# EAGLE design esp8266 (EAGLE 9.5.1)
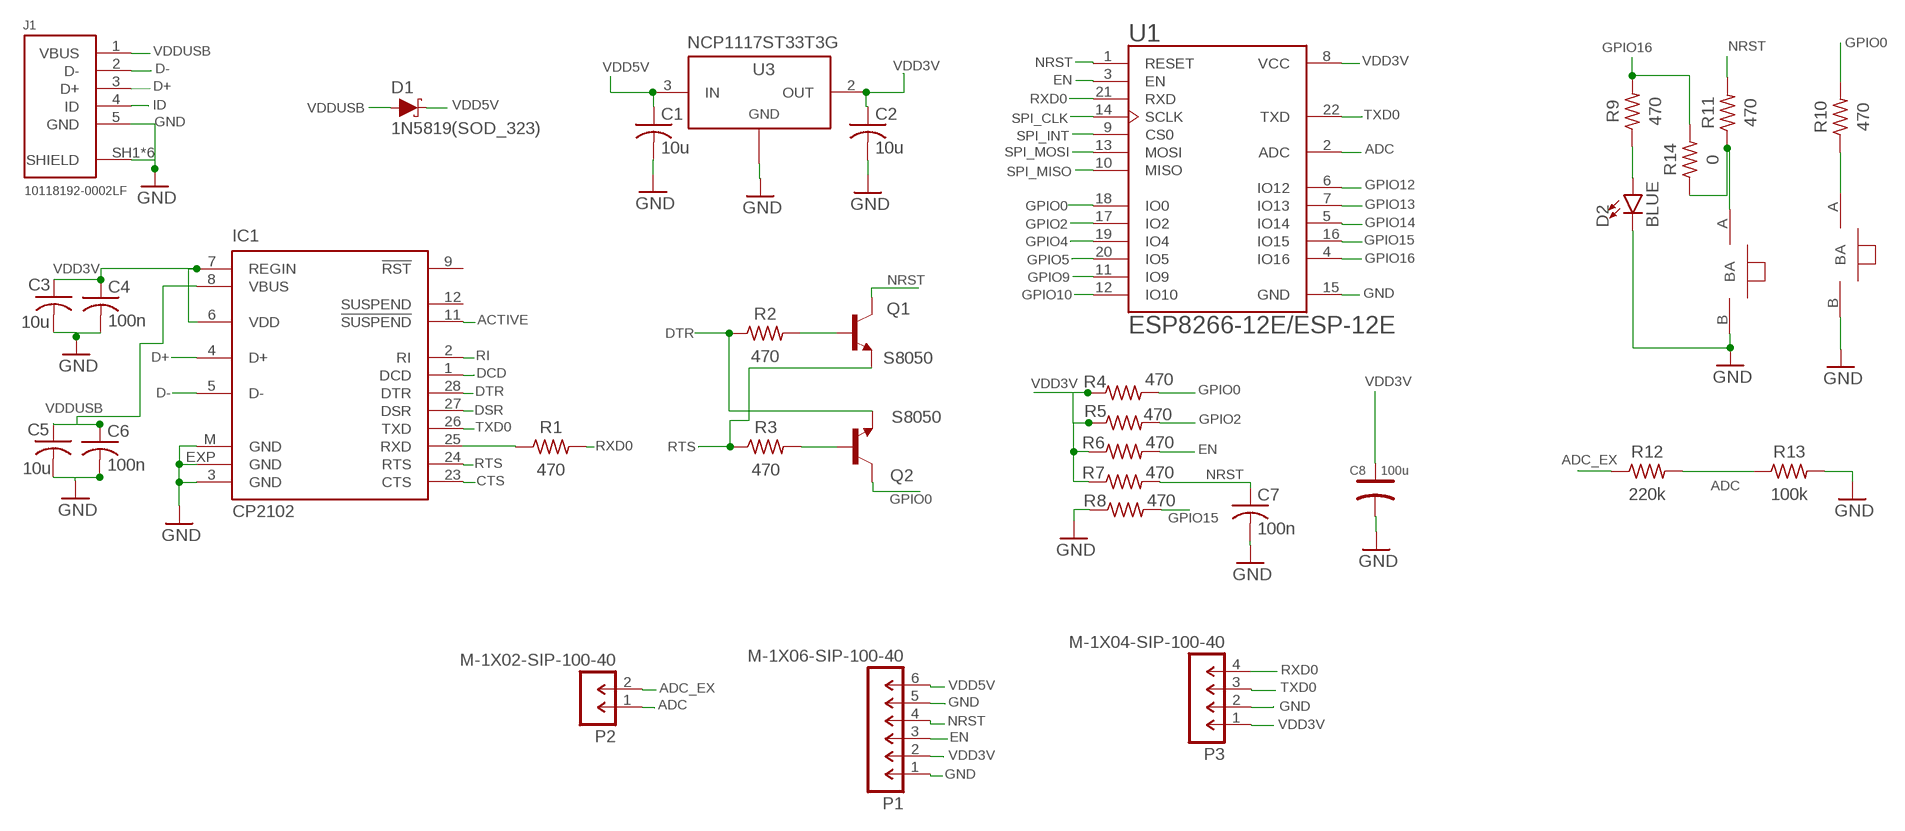
[diagram p0: schematic, sheet 1]

## Parts
C1  10u  C-US_CHIP-0805(2012-METRIC)  [CAPC2012X110]
C2  10u  C-US_CHIP-0402(1005-METRIC)  [CAPC1005X60]
C3  10u  C-US_CHIP-0402(1005-METRIC)  [CAPC1005X60]
C4  100n  C-US_CHIP-0402(1005-METRIC)  [CAPC1005X60]
C5  10u  C-US_CHIP-0402(1005-METRIC)  [CAPC1005X60]
C6  100n  C-US_CHIP-0402(1005-METRIC)  [CAPC1005X60]
C7  100n  C-US_CHIP-0402(1005-METRIC)  [CAPC1005X60]
C8  100u  TANTALUM-SMD-100UF-6.3V(AVX-B)  [AVX-B]
D1  1N5819(SOD_323)  DIODE-SCHOTTKY-BAT20J  [SOD-323]
D2  BLUE  LED-BLUE0603  [LED-0603]
IC1  CP2102  [MLP28]
J1  10118192-0002LF  [10118192-0002LF]
P1  M-1X06-SIP-100-40  [SIP-100-06-40]
P2  M-1X02-SIP-100-40  [SIP-100-02-40]
P3  M-1X04-SIP-100-40  [SIP-100-04-40]
Q1  S8050  BCX70SMD  [SOT23]
Q2  S8050  BCX70SMD  [SOT23]
R1  470  R-US_CHIP-0402(1005-METRIC)  [RESC1005X40]
R2  470  R-US_CHIP-0402(1005-METRIC)  [RESC1005X40]
R3  470  R-US_CHIP-0402(1005-METRIC)  [RESC1005X40]
R4  470  R-US_CHIP-0402(1005-METRIC)  [RESC1005X40]
R5  470  R-US_CHIP-0402(1005-METRIC)  [RESC1005X40]
R6  470  R-US_CHIP-0402(1005-METRIC)  [RESC1005X40]
R7  470  R-US_CHIP-0402(1005-METRIC)  [RESC1005X40]
R8  470  R-US_CHIP-0402(1005-METRIC)  [RESC1005X40]
R9  470  R-US_CHIP-0402(1005-METRIC)  [RESC1005X40]
R10  470  R-US_CHIP-0402(1005-METRIC)  [RESC1005X40]
R11  470  R-US_CHIP-0402(1005-METRIC)  [RESC1005X40]
R12  220k  R-US_CHIP-0402(1005-METRIC)  [RESC1005X40]
R13  100k  R-US_CHIP-0402(1005-METRIC)  [RESC1005X40]
R14  0  R-US_CHIP-0402(1005-METRIC)  [RESC1005X40]
U1  ESP8266-12E/ESP-12E  [XCVR_ESP8266-12E/ESP-12E]
U3  NCP1117ST33T3G  [SOT-223]
U$2  PT_820  [PT_820]
U$3  PT_820  [PT_820]

## Nets
ACTIVE: IC1.11(!SUSPEND)
ADC: P2.1 R12.2 R13.1 U1.2(ADC)
ADC_EX: P2.2 R12.1
CTS: IC1.23(CTS)
D+: IC1.4(D+) J1.3(D+)
D-: IC1.5(D-) J1.2(D-)
DCD: IC1.1(DCD)
DSR: IC1.27(DSR)
DTR: IC1.28(DTR) Q2.2(E) R2.1
EN: P1.3 R6.2 U1.3(EN)
GND: C1.2 C2.2 C3.2 C4.2 C5.2 C6.2 C7.2 C8.- D2.C IC1.3(GND) IC1.EXP(GND) IC1.M(GND) J1.5(GND) J1.SH1(SHIELD) J1.SH2(SHIELD) J1.SH3(SHIELD) J1.SH4(SHIELD) J1.SH5(SHIELD) J1.SH6(SHIELD) P1.1 P1.5 P3.2 R8.1 R13.2 U1.15(GND) U3.1(ADJ/GND) U$2.B U$3.B
GPIO0: Q2.3(C) R4.2 R10.2 U1.18(IO0)
GPIO2: R5.2 U1.17(IO2)
GPIO4: U1.19(IO4)
GPIO5: U1.20(IO5)
GPIO9: U1.11(IO9)
GPIO10: U1.12(IO10)
GPIO12: U1.6(IO12)
GPIO13: U1.7(IO13)
GPIO14: U1.5(IO14)
GPIO15: R8.2 U1.16(IO15)
GPIO16: R9.2 R14.2 U1.4(IO16)
ID: J1.4(ID)
N$1: D2.A R9.1
N$2: Q1.1(B) R2.2
N$4: R11.1 R14.1 U$2.A
N$5: Q2.1(B) R3.2
N$6: R10.1 U$3.A
NRST: C7.1 P1.4 Q1.3(C) R7.2 R11.2 U1.1(RESET)
RI: IC1.2(RI)
RTS: IC1.24(RTS) Q1.2(E) R3.1
RX: IC1.25(RXD) R1.1
RXD0: P3.4 R1.2 U1.21(RXD)
SPI_CLK: U1.14(SCLK)
SPI_INT: U1.9(CS0)
SPI_MISO: U1.10(MISO)
SPI_MOSI: U1.13(MOSI)
TXD0: IC1.26(TXD) P3.3 U1.22(TXD)
VDD3V: C2.1 C3.1 C4.1 C8.+ IC1.6(VDD) IC1.7(REGIN) P1.2 P3.1 R4.1 R5.1 R6.1 R7.1 U1.8(VCC) U3.2(OUT) U3.4
VDD5V: C1.1 D1.C P1.6 U3.3(IN)
VDDUSB: C5.1 C6.1 D1.A IC1.8(VBUS) J1.1(VBUS)
Unconnected: IC1.9(!RST) IC1.12(SUSPEND)

## Library data of the parts
C1-C7 = Capacitor:C-US: Capacitor - ANSI; CATEGORY: Capacitor
C8 = TANTALUM-SMD-100UF-6.3V_AVX-B_:TANTALUM-SMD-100UF-6.3V(AVX-B): 302020017 Check prices <https://pricing.snapeda.com/parts/TAJB107M006RNJ/AVX%20Interconnect%20/%20Elco/view-part?ref=eda>; AVAILABILITY: Warning; DESCRIPTION: 100µF Molded Tantalum Capacitors 6.3V 1411 (3528 Metric), 1210 1.7Ohm; MF: AVX Interconnect / Elco; MP: TAJB107M006RNJ; PACKAGE: 1210 AVX Interconnect / Elco; PRICE: None; PURCHASE-URL: https://pricing.snapeda.com/search/part/TAJB107M006RNJ/?ref=eda
D1 = SparkFun-DiscreteSemi:DIODE-SCHOTTKY: Schottky diode A Schottky diode is a semiconductor diode which has a low forward voltage drop and a very fast switching action.; PROD_ID: DIO-11623; VALUE: 1A/23V/620mV
D2 = SparkFun-LED:LED-BLUE: Blue SMD LED Used in manufacturing of various products at SparkFun Packages: 0603 - SMD 0603 package [Product Link] <http://www.digikey.com/product-detail/en/SMLE12BC7TT86/511-1589-2-ND/1641808> 1206 - SMD1206 package [Product Link] <http://www.digikey.com/product-detail/en/lite-on-inc/LTST-C150TBKT/160-1643-1-ND/573584> SparkFun Products: ESP8266 Thing-Dev Board <https://www.sparkfun.com/products/13711> RedBoard <https://www.sparkfun.com/products/12757>; PROD_ID: DIO-08575
IC1 = silabs-2:CP210*: Single-Chip USB to UART Bridge Source: www.silabs.com .. CP2101.pdf / cp2102.pdf
J1 = USB connector:10118192-0002LF: CONN RCPT USB2.0 MICRO B SMD R/A Manufacturer's datasheet <https://www.amphenol-icc.com/media/wysiwyg/files/drawing/10118192.pdf>; CREATED_BY: PCBLayout.com; DIGIKEY_PARTNO: 609-5379-2-ND; MANUFACTURER: Amphenol ICC (FCI); MPN: 10118192-0002LF
P1 = con-headers-jp:M-1X06-: MALE HEADER
P2 = con-headers-jp:M-1X02-: MALE HEADER
P3 = con-headers-jp:M-1X04-: MALE HEADER
Q1 Q2 = transistor-npn:BCX70*: NPN Transistor
R1-R14 = Resistor:R-US: Resistor Fixed - ANSI; CATEGORY: Resistor; SUB-CATEGORY: Fixed
U1 = ESP8266-12E_ESP-12E:ESP8266-12E/ESP-12E: ESP-12E WiFi Module; AVAILABILITY: Unavailable; DESCRIPTION: This WiFi module has a 32-bit MCU micro and clock speeds supporting 80 MHz or 160 MHz. Supports the RTOS and integrated Wi-Fi MAC/BB/RF/PA/LNA, and has an on-board antenna.; MF: AI-Thinker; MP: ESP8266-12E/ESP-12E; PACKAGE: None; PRICE: None
U3 = IC:NCP1117ST33T3G: IC REG LINEAR 3.3V 1A SOT223 Manufacturer's datasheet <https://www.onsemi.com/pub/Collateral/NCP1117-D.PDF>; CREATED_BY: PCBLayout.com; DIGIKEY_PART_NUMBER: NCP1117ST33T3GOSTR-ND; MANUFACTURER: ON Semiconductor; MPN: NCP1117ST33T3G; PACKAGE: SOT-223
U$2 U$3 = PT_820:PT_820

## Board
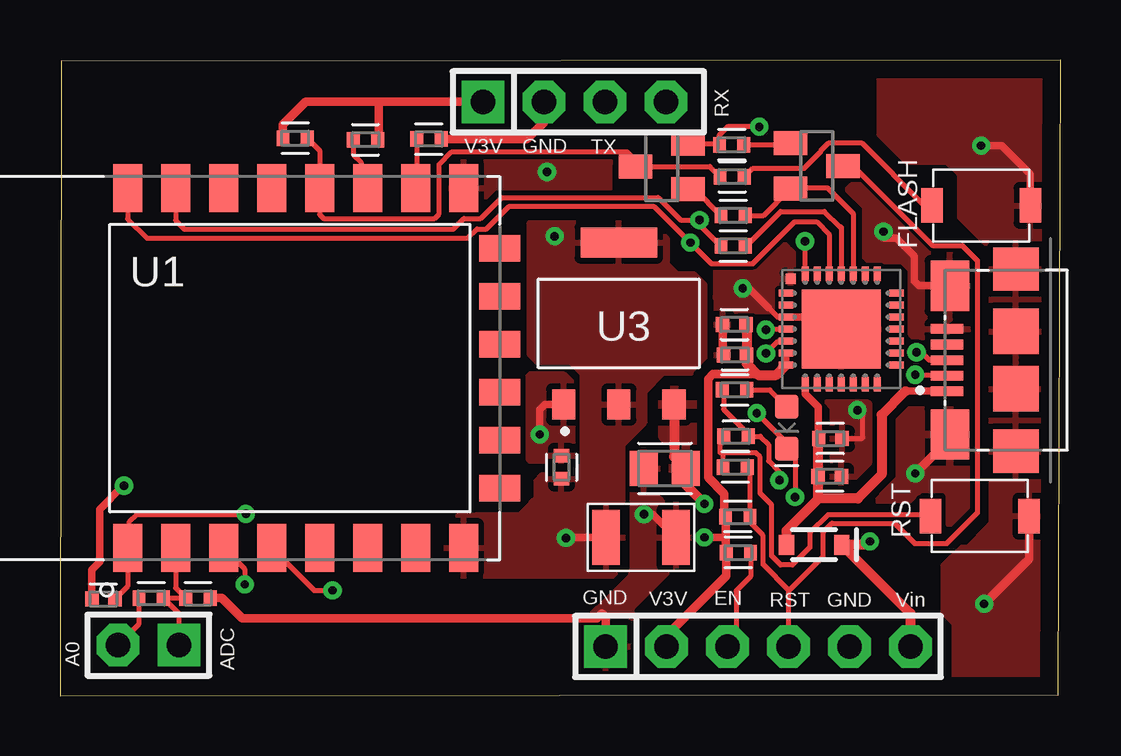
[diagram p1: board, top side]
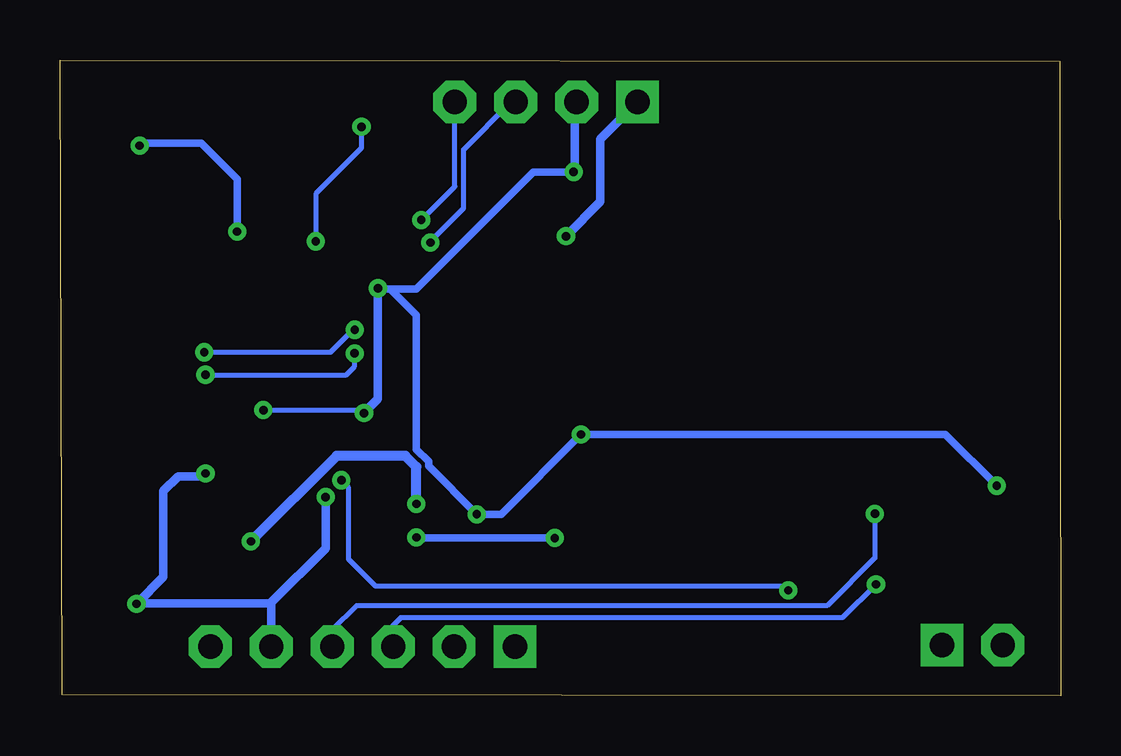
[diagram p2: board, bottom side, seen from below]

Size 41.7 x 26.51 mm. Coordinates in mm from the lower left corner, seen from the top.
Outline: 0,0 41.6,0.05 41.7,26.51 0.05,26.46 0,0
Copper layers (1*16): Top 0.035mm / dielectric 1.5mm / Bottom 0.035mm
Design rules "default *": minimum track width 6mil, minimum drill 0.35mm, track to track 6mil, track to pad 6mil, pad to pad 6mil, via to via 6mil, smd to smd 6mil, copper to edge 30mil, drill to drill 6mil, minimum pad ring 10mil, minimum via ring 8mil, stop-mask expansion 4mil, vias tented up to drill 0mil, thermal gap 10mil

### Footprints (pad centres in the part's own frame; a part is rotated, then mirrored left to right if it is on the bottom)
CAPC2012X110 = smd 1.165 x 1.465: 1 -0.875,0; 2 0.875,0
CAPC1005X60 = smd 0.56 x 0.629: 1 -0.485,0; 2 0.485,0
AVX-B = smd 1.143 x 2.286: + -1.46,0; - 1.46,0
SOD-323 = smd 0.63 x 0.83: A 1.15,0; C -1.15,0
LED-0603 = smd 1 x 1: A -0.877,0; C 0.877,0
MLP28 = smd 0.6 x 0.3: 1 -2.3,1.5; 2 -2.3,1; 3 -2.3,0.5; 4 -2.3,0; 5 -2.3,-0.5; 6 -2.3,-1; 7 -2.3,-1.5; 15 2.3,-1.5; 16 2.3,-1; 17 2.3,-0.5; 18 2.3,0; 19 2.3,0.5; 20 2.3,1; 21 2.3,1.5 | smd 0.3 x 0.6: 8 -1.5,-2.3; 9 -1,-2.3; 10 -0.5,-2.3; 11 0,-2.3; 12 0.5,-2.3; 13 1,-2.3; 14 1.5,-2.3; 22 1.5,2.3; 23 1,2.3; 24 0.5,2.3; 25 0,2.3; 26 -0.5,2.3; 27 -1,2.3; 28 -1.5,2.3 | smd 3.3 x 3.3: EXP 0,0 | smd 0.435 x 0.435: M -2.103,2.103
10118192-0002LF = smd 0.4 x 1.35: 1 -1.3,2.875; 2 -0.65,2.875; 3 0,2.875; 4 0.65,2.875; 5 1.3,2.875 | smd 2.1 x 1.6: SH1 -3.1,2.75; SH2 3.1,2.75 | smd 1.8 x 1.9: SH3 -3.8,0; SH4 3.8,0 | smd 1.9 x 1.9: SH5 -1.2,0; SH6 1.2,0
SIP-100-06-40 = drill 1.016 pad 1.778 square: 1 -6.35,0 | drill 1.016 pad 1.778 octagon: 2 -3.81,0; 3 -1.27,0; 4 1.27,0; 5 3.81,0; 6 6.35,0
SIP-100-02-40 = drill 1.016 pad 1.778 square: 1 -1.27,0 | drill 1.016 pad 1.778 octagon: 2 1.27,0
SIP-100-04-40 = drill 1.016 pad 1.778 square: 1 -3.81,0 | drill 1.016 pad 1.778 octagon: 2 -1.27,0; 3 1.27,0; 4 3.81,0
SOT23 = smd 1 x 1.4: 1 -0.95,-1.1; 2 0.95,-1.1; 3 0,1.1
RESC1005X40 = smd 0.535 x 0.644: 1 -0.507,0; 2 0.507,0
XCVR_ESP8266-12E/ESP-12E = smd 2 x 1.2: 1 -7.5,7; 2 -7.5,5; 3 -7.5,3; 4 -7.5,1; 5 -7.5,-1; 6 -7.5,-3; 7 -7.5,-5; 8 -7.5,-7; 15 7.5,-7; 16 7.5,-5; 17 7.5,-3; 18 7.5,-1; 19 7.5,1; 20 7.5,3; 21 7.5,5; 22 7.5,7 | smd 1.1 x 1.7: 9 -5,-8.5; 10 -3,-8.5; 11 -1,-8.5; 12 1,-8.5; 13 3,-8.5; 14 5,-8.5
SOT-223 = smd 1.26 x 0.96: 1 -3.375,2.3; 2 -3.375,0; 3 -3.375,-2.3 | smd 1.26 x 3.19: 4 3.375,0
PT_820 = smd 0.9 x 1.45: A -2.05,0; B 2.05,0

### Placement (x,y rotation side)
C1  25.2,9.48 180 top
C2  20.9,9.53 90 top
C3  28.1,15.48 180 top
C4  28.12,14.21 180 top
C5  32.1,10.73 0 top
C6  32.07,9.15 0 top
C7  1.81,4.04 180 top
C8  24.21,6.6 0 top
D1  31.42,6.3 180 top
D2  30.28,11.18 270 top
IC1  32.55,15.29 0 top
J1  39.83,14 90 top
P1  29.08,2.06 0 top
P2  3.68,2.11 180 top
P3  21.44,24.77 0 top
Q1  31.53,22.09 270 top
Q2  25.07,22.07 90 top
R1  28.05,18.76 180 top
R2  27.99,22.97 0 top
R3  28.05,20.03 180 top
R4  9.8,23.25 0 top
R5  12.73,23.19 180 top
R6  28.26,5.97 0 top
R7  28.24,7.47 0 top
R8  15.37,23.21 180 top
R9  28.11,12.76 180 top
R10  28.01,21.64 180 top
R11  28.13,9.54 0 top
R12  3.8,4.08 0 top
R13  5.75,4.08 0 top
R14  28.17,10.82 0 top
U1  9.82,13.66 90 top
U3  23.28,15.53 90 top
U$2  38.33,7.49 0 top
U$3  38.38,20.45 0 top

### Tracks (layer width: path | path; a pad name or v marks a point on that pad's centre or on a via)
ADC
  Top 0.203: U1.2 4.82,4.5 R13.1 R12.2 4.95,3.44 P2.1
ADC_EX
  Top 0.203: P2.2 3.28,2.97 3.28,3.43 3.29,3.45 R12.1
D+  (via drill 0.35)
  Top 0.203: v29.41,15.26 29.44,15.29 IC1.4 | v35.69,14.33 35.89,14.33 36.22,14 J1.3
  Bottom 0.203: v29.41,15.26 29.49,15.26 30.42,14.33 v35.69,14.33
D-  (via drill 0.35)
  Top 0.203: v29.42,14.27 29.93,14.79 IC1.5 | v35.64,13.39 36.91,13.39 J1.2
  Bottom 0.203: v29.42,14.27 29.42,13.74 29.77,13.39 v35.64,13.39
DTR  (via drill 0.35)
  Top 0.203: Q2.2 27.43,23.02 R2.1 27.48,23.38 27.82,23.72 v29.13,23.72 | IC1.28 31.05,18.94 v31.04,18.95
  Bottom 0.203: v29.13,23.72 29.13,22.83 31.04,20.93 v31.04,18.95
EN  (via drill 0.35)
  Top 0.203: U1.3 7.7,5.29 v7.7,4.65 | P1.3 28.17,2.41 28.17,4.37 28.77,4.98 R6.2
  Bottom 0.203: v7.7,4.65 9.09,3.25 27.51,3.25 27.81,2.95 P1.3
GND  (via drill 0.35)
  Top 0.203: IC1.3 29.91,15.79 29.52,16.18 | C5.2 33.39,10.73 33.4,10.72 33.45,10.77 33.45,11.68 v33.22,11.91 | v29.03,11.79 30.28,10.53 D2.C 30.63,9.96 v30.63,8.29
  Top 0.305: IC1.3 32.05,15.79 IC1.EXP | v28.45,16.99 28.7,16.99 29.52,16.18 | C8.- 24.7,7.57 v24.33,7.57 | v19.99,10.9 19.99,11.94 20.2,12.15 U3.1 | J1.SH2 35.79,17.1 35.59,17.3 35.59,18.34 34.85,19.08 34.32,19.08 v34.32,19.35 | v38.38,22.94 39.24,22.94 40.44,21.74 U$3.B | C7.2 1.32,5.26 1.65,5.59 1.65,7.78 2.64,8.76 v2.67,8.76
  Top 0.356: P3.2 20.17,23.93 19.45,23.21 R8.1 | R13.2 6.74,4.08 7.59,3.23 22.38,3.23 22.58,3.43 22.73,3.28 P1.1 | C3.2 27.61,14.24 C4.2 | v38.51,3.84 40.38,5.71 U$2.B | v35.64,9.27 37.08,10.71 J1.SH1
  Bottom 0.203: P3.2 20.24,24.69 | 20.24,21.87 20.27,21.84 v20.29,21.84 | v33.22,11.91 29.16,11.91 v29.03,11.79
  Bottom 0.305: v20.29,21.84 21.97,21.84 26.85,16.97 27.94,16.97 | v28.45,16.99 28.42,16.97 27.94,16.97 | 27.94,16.97 26.85,15.87 26.85,10.27 26.34,9.76 26.34,9.58 v24.33,7.57 23.32,7.57 v19.99,10.9 4.8,10.9 v2.67,8.76 | v34.32,19.35 34.32,21.54 35.81,23.04 38.23,23.04 38.33,22.94 v38.38,22.94
  Bottom 0.356: 20.24,24.69 20.24,21.87 | v28.45,16.99 28.45,12.37 v29.03,11.79 | v30.63,8.29 30.63,6.15 32.89,3.89 | P1.5 32.89,3.89 | 32.89,3.89 32.92,3.86 38.51,3.86 v38.51,3.84 37.39,4.95 37.39,8.53 36.78,9.14 35.74,9.14 35.64,9.25 v35.64,9.27
  pour Top: 19.58,13.44 20.98,13.44 21.01,13.41 21.36,13.06 21.36,10.26 21.36,9.91 21.31,9.86 21.23,9.78 19.58,9.78 19.51,9.86 19.51,13.34
  pour Top: 23.83,10.03 23.83,5.31 23.75,4.95 22.45,3.66 22.4,3.66 21.95,3.2 21.95,1.19 22,1.14 23.57,1.14 23.67,1.24 23.67,2.95 23.85,3.12 23.85,3.66 25.6,5.41 26.16,5.41 26.34,5.59 26.34,7.65 26.01,7.98 25.25,7.98 24.92,8.31 24.92,9.96 24.94,9.98 24.77,10.16 23.95,10.16
  pour Top: 34.11,25.78 34.11,23.42 34.16,23.37 35.28,22.25 36.96,22.25 37.46,21.74 37.46,19.96 38.79,18.64 38.79,8.71 38.79,7.19 38.68,7.09 37.8,6.2 37.57,6.2 36.78,5.41 36.78,4.52 36.78,3.48 37.24,3.02 37.24,0.84 37.29,0.79 37.36,0.71 41.3,0.71 41.3,25.73 41.35,25.78
  pour Top: 33.73,12.17 33.73,9.7 32.89,8.86 32.23,8.86 32.18,8.92 32.18,11.43 32.18,11.94 32.21,11.96 32.21,11.99 31.93,12.27 33.66,12.27 33.76,12.17
  pour Top: 16.28,22.07 16.28,20.83 16.31,20.8 16.31,20.6 16.56,20.35 17.3,20.35 17.37,20.42 18.14,21.18 18.9,21.18 22.91,21.18 22.94,21.16 22.94,22.2 22.99,22.25 16.46,22.25 16.31,22.1
  pour Top: 33.66,22.48 33.66,21.49 33.17,21.49 32.79,21.11 33.5,20.4 33.5,18.29 33.68,18.11 35.08,18.11 35.41,17.78 35.41,15.09 35.64,14.86 35.89,14.86 36.2,15.16 36.42,15.16 37.69,15.16 37.74,15.11 37.85,15.21 37.85,19 34.01,22.83
  pour Top: 27.33,16.84 27.33,14.02 27.36,14 27.38,13.97 27.86,13.97 27.86,15.93 27.97,16.03 29.64,16.03 29.72,16.1 29.74,16.13 29.74,16.97 29.97,17.2 30.58,17.2 30.58,18.47 30.45,18.59 30.25,18.8 30.05,18.8 28.98,17.73 27.28,17.73 27.3,17.7 27.3,16.56
  pour Top: 34.11,16.81 30.99,16.81 30.99,13.72 34.14,13.72 34.14,16.79
  pour Top: 37.77,11.91 35.41,11.91 34.98,11.48 34.98,9.17 35.03,9.12 34.29,8.38 34.09,8.15 35.41,8.18 35.81,8.59 35.84,8.61 36.86,8.61 37.06,8.41 37.06,7.16 37.77,7.87 37.77,11.86
GPIO0
  Top 0.203: R4.2 10.82,22.73 U1.18 10.82,20.06 10.98,19.91 15.61,19.91 15.8,20.09 15.8,22.15 16.33,22.68 23.62,22.68 23.97,22.33 Q2.3 27.08,22.07 R10.2
GPIO2
  Top 0.203: R5.2 12.22,22.55 12.54,22.23 12.54,21.44 U1.17
GPIO15
  Top 0.203: R8.2 14.87,21.2 U1.16
GPIO16  (via drill 0.35)
  Top 0.203: U1.4 10.59,4.39 v11.35,4.39 | R9.2 27.65,12.71 27.65,11.95 28.68,10.92 R14.2 29.18,10.82 29.53,10.48 29.53,9.78 29.97,9.34 v29.97,8.99
  Bottom 0.203: v11.35,4.39 11.53,4.57 28.55,4.57 29.67,5.69 29.67,8.69 v29.97,8.99
N$1
  Top 0.203: R9.1 29.58,12.76 D2.A
N$2
  Top 0.203: R2.2 30.36,22.97 Q1.1
N$4
  Top 0.203: R14.1 27.5,10.66 27.5,10.13 27.62,10.13 | 27.62,10.13 R11.1 | U$2.A 36.23,7.54 32.01,7.54 31.25,6.78 31.25,6.19 30.52,5.45 30.03,5.45 29.65,5.83 29.65,7.96 29.17,8.44 29.17,9.96 29,10.13 27.62,10.13
N$5
  Top 0.203: Q2.1 26.45,21.12 R3.2
N$6
  Top 0.203: U$3.A 36.02,20.45 33.43,23.04 32.02,23.04 31.68,22.7 31.68,22.66 31.01,22 28.87,22 R10.1
NRST  (via drill 0.35)
  Top 0.203: R11.2 28.75,9.43 R7.2 28.63,7.35 29.3,6.68 29.3,5.48 30.35,4.42 | C7.1 2.82,4.57 U1.1 2.9,6.23 2.9,7.26 3.2,7.57 7.72,7.57 v7.74,7.59 | 30.35,4.42 P1.4 | Q1.3 33.05,22.09 36.36,18.78 37.6,18.78 38.23,18.15 38.23,7.62 36.96,6.35 35.61,6.35 34.77,7.19 32.16,7.19 31.8,6.83 31.8,5.81 30.42,4.42 30.35,4.42
  Bottom 0.203: v7.74,7.59 7.74,5.74 9.73,3.76 29.34,3.76 30.35,2.74 P1.4
RTS
  Top 0.203: R3.1 29.32,20.03 Q1.2 30.47,21.18 31.98,21.18 33.05,20.11 IC1.24
RX
  Top 0.203: R1.1 28.59,18.76 30.02,20.19 31.85,20.19 32.49,19.56 32.55,19.56 IC1.25
RXD0  (via drill 0.35)
  Top 0.203: U1.21 4.82,19.82 5.18,19.46 16.38,19.46 16.83,19.91 17.53,19.91 18.4,20.78 24.92,20.78 25.86,19.84 v26.64,19.84 26.64,19.65 R1.2
  Bottom 0.203: v26.64,19.84 25.25,21.23 P3.4
TXD0  (via drill 0.35)
  Top 0.203: U1.22 2.82,19.88 3.63,19.08 16.98,19.08 17.37,19.46 17.76,19.46 18.69,20.4 24.77,20.4 v26.26,18.9 27.16,18 28.85,18 30.61,19.76 31.52,19.76 32.05,19.23 IC1.26
  Bottom 0.203: P3.3 22.89,24.76 24.89,22.76 24.89,20.31 26.26,18.94 v26.26,18.9
VDD3V  (via drill 0.35)
  Top 0.305: IC1.6 IC1.7 | C8.+ 21.1,6.6 v21.08,6.58 | v26.85,6.6 27.68,6.6 27.73,6.55
  Top 0.356: P1.2 25.27,2.52 27.76,5.01 R6.1 27.73,6 27.73,6.55 R7.1 27.69,7.52 27.69,8.42 27,9.1 27,13.22 27.2,13.41 29.02,13.41 29.04,13.39 29.08,13.39 | 13.28,24.76 10.24,24.76 9.29,23.82 R4.1 | 13.28,24.76 P3.1 | 13.28,24.76 13.28,23.23 R5.1
  Top 0.406: IC1.7 29.85,13.39 29.08,13.39 28.61,13.86 C4.1 28.61,15.46 C3.1
  Bottom 0.305: v26.85,6.6 26.82,6.58 v21.08,6.58
  Bottom 0.356: P3.1 19.18,23.22 19.18,20.6 v20.61,19.16
  pour Top: 19.56,19.74 24.64,19.74 25.3,19.08 25.3,18.11 25.25,18.06 25.7,17.6 26.42,17.6 26.87,17.14 26.87,14.1 26.29,13.51 26.29,13.44 25.12,13.44 25.1,13.41 24.36,12.67 24.36,11.38 23.44,10.46 23.44,8.36 23.44,5.41 23.39,5.36 23.01,4.98 16.61,4.98 16.31,4.98 16.1,5.18 16.1,7.04 16.18,7.11 16.61,7.54 17.35,7.54 17.37,7.57 19.18,7.57 19.63,8.03 19.63,8.08 19.84,8.28 19.84,8.97 20.09,9.22 21.11,9.22 21.18,9.3 21.41,9.3 21.77,9.65 21.77,9.75 21.77,13.41 21.46,13.72 21.31,13.87 19.91,13.87 19.56,14.22 19.56,19.66
VDD5V  (via drill 0.35)
  Top 0.406: U3.3 25.58,9.97 C1.1 26.08,8.79 26.85,8.02 v26.85,8 | P1.6 35.43,3.44 D1.C 33.61,6.3 v33.74,6.44
  Bottom 0.406: v26.85,8 26.85,9.55 27.31,10.01 30.18,10.01 v33.74,6.44
  pour Top: 26.26,12.75 25.45,12.75 25.4,12.7 25.1,12.4 25.1,11.35 25.1,10.82 25.53,10.39 25.53,9.32 25.53,8.86 25.55,8.89 26.44,8.89 26.37,8.97 26.37,12.67
VDDUSB
  Top 0.305: IC1.8 31.05,12.59 31.59,12.05 31.59,10.7 | 35.23,12.7 36.95,12.7 J1.1
  Top 0.406: C5.1 31.59,10.7 C6.1 31.59,8.21 | 31.59,8.21 31.6,8.22 33.24,8.22 34.24,9.22 34.24,11.71 35.23,12.7 | 31.59,8.21 30.27,6.89 D1.A

### Text on the board
tPlace: RX | V3V | GND | TX | FLASH | RST | GND | V3V | EN | RST | GND | Vin | A0 | ADC